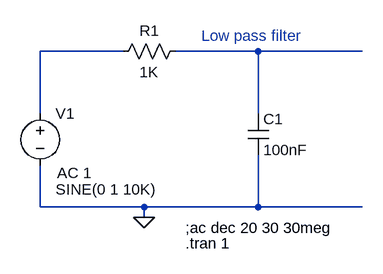
[diagram p0: schematic sch.asc]
sch.asc, the LTspice schematic file:
Version 4
SHEET 1 880 680
WIRE 240 32 112 32
WIRE 448 32 320 32
WIRE 608 32 448 32
WIRE 112 128 112 32
WIRE 448 128 448 32
WIRE 112 272 112 208
WIRE 272 272 112 272
WIRE 448 272 448 192
WIRE 448 272 272 272
WIRE 608 272 448 272
WIRE 272 288 272 272
FLAG 272 288 0
SYMBOL voltage 112 112 R0
WINDOW 3 24 133 Left 2
WINDOW 123 26 107 Left 2
WINDOW 39 0 0 Left 0
SYMATTR Value SINE(0 1 10K)
SYMATTR Value2 AC 1
SYMATTR InstName V1
SYMBOL res 336 16 R90
WINDOW 0 0 56 VBottom 2
WINDOW 3 32 56 VTop 2
SYMATTR InstName R1
SYMATTR Value 1K
SYMBOL cap 432 128 R0
SYMATTR InstName C1
SYMATTR Value 100nF
TEXT 336 304 Left 2 !;ac dec 20 30 30meg
TEXT 336 328 Left 2 !.tran 1
TEXT 360 8 Left 2 ;Low pass filter

The netlist it stands for:
* sch.asc
V1 N001 0 SINE(0 1 10K) AC 1
R1 N002 N001 1K
C1 N002 0 100nF
;ac dec 20 30 30meg
.tran 1
* Low pass filter
.backanno
.end